# Altium schematic sheet power.SchDoc
size A4
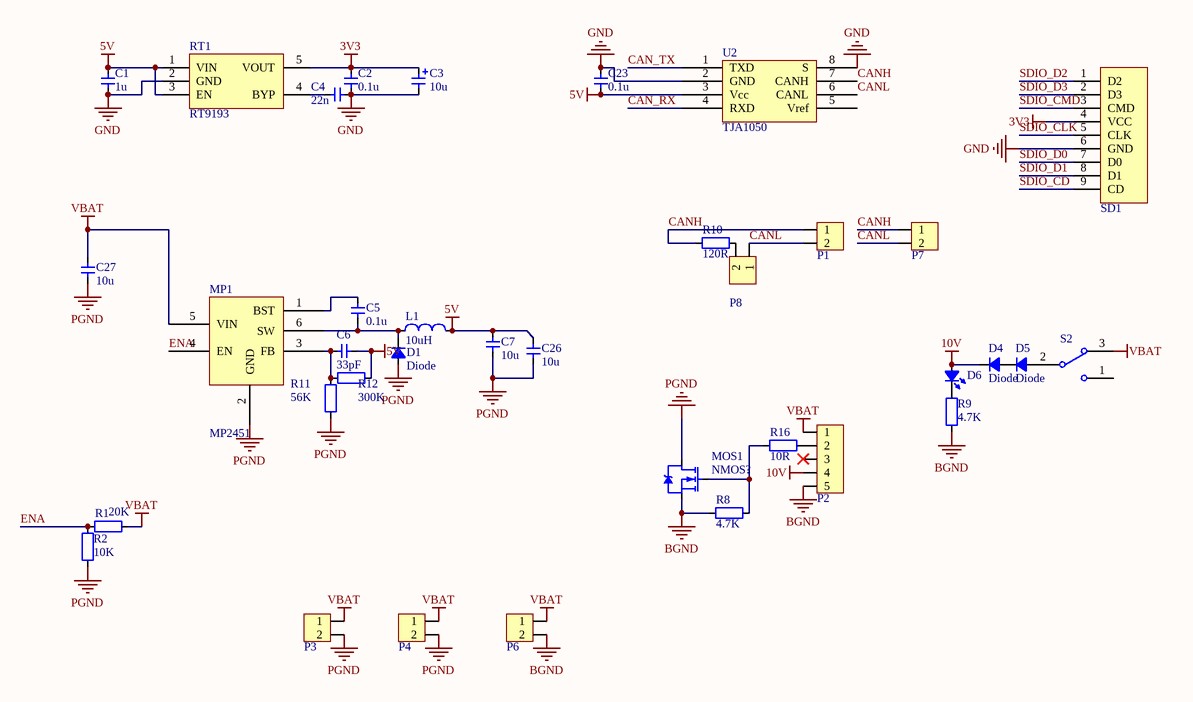
[diagram p0: power.SchDoc]

## Parts
C1  value 1u  [CAP_0603]  (hidden comment: Cap_0603)
C2  value 0.1u  [CAP_0603]  (hidden comment: Cap_0603)
C3  value 10u  [CAP_TAN_P0805]  (hidden comment: Cap_Tan_0805)
C4  value 22n  [CAP_0603]  (hidden comment: Cap_0603)
C5  value 0.1u  [CAP_0603]  (hidden comment: Cap_0603)
C6  value 33pF  [CAP_0603]  (hidden comment: Cap_0603)
C7  value 10u  [CAP_0805]  (hidden comment: Cap_0805)
C23  value 0.1u  [CAP_0603]  (hidden comment: Cap_0603)
C26  value 10u  [CAP_0805]  (hidden comment: Cap_0805)
C27  value 10u  [CAP_0805]  (hidden comment: Cap_0805)
D1  Diode  [LED_0805_RED]
D4  Diode  [LED_0805_RED]
D5  Diode  [LED_0805_RED]
D6  LED_0805  [LED_0805_RED]  (value not drawn)
L1  value 10uH  [IND_CD52]  (hidden comment: Ind_CD32)
MOS1  value NMOS?  [TO-252AA]  (hidden comment: MOSFET_N)
MP1  MP2451  [SOT23-6]
P1  HDR1x2_2.54  [HDR1X2_2.54_90]  (value not drawn)
P2  HDR1x5_2.54  [HDR1X5_2.54_180]  (value not drawn)
P3  Connector  [XT30_PW_M]  (value not drawn)
P4  Connector  [XT30_PW_M]  (value not drawn)
P6  Connector  [XT30_PW_M]  (value not drawn)
P7  HDR1x2_2.54  [HDR1X2_2.54_90]  (value not drawn)
P8  HDR1x2_2.54  [HDR1X2_2.54_180]  (value not drawn)
R1  value 20K  [RES_0603]  (hidden comment: Res_0603)
R2  value 10K  [RES_0603]  (hidden comment: Res_0603)
R8  value 4.7K  [RES_0603]  (hidden comment: Res_0603)
R9  value 4.7K  [RES_0603]  (hidden comment: Res_0603)
R10  value 120R  [RES_0603]  (hidden comment: Res_0603)
R11  value 56K  [RES_0603]  (hidden comment: Res_0603)
R12  value 300K  [RES_0603]  (hidden comment: Res_0603)
R16  value 10R  [RES_0603]  (hidden comment: Res_0603)
RT1  RT9193  [SOT23-5]
S2  SwitchSPDT_2.8x6.6_90  [SwitchSPDT_2.8X6.6_90]  (value not drawn)
SD1  SD_Card_TF  [SD_Card_TF]  (value not drawn)
U2  TJA1050  [SOP_E150_8]

## Nets
3V3: C2.2 C3.1 RT1.5(VOUT) SD1.4(VCC)
5V: C1.2 C6.1 C7.2 C23.1 C26.2 L1.2 R12.2 RT1.1(VIN) RT1.3(EN) U2.3(Vcc)
10V: D4.2(K) D6.1(A) P2.4
BGND: MOS1.3(S) P2.5 P6.2 R8.2 R9.1
GND: C1.1 C2.1 C3.2 C4.1 C23.2 RT1.2(GND) SD1.6(GND) U2.2(GND) U2.8(S)
PGND: C7.1 C26.1 C27.1 D1.1(A) MOS1.4(D) MP1.2(GND) P3.2 P4.2 R2.2 R11.2
VBAT: C27.2 MP1.5(VIN) P2.1 P3.1 P4.1 P6.1 R1.2 S2.3
CAN_RX: U2.4(RXD)
CAN_TX: U2.1(TXD)
CANH: P1.1 P7.1 R10.2 U2.7(CANH)
CANL: P1.2 P7.2 P8.1 U2.6(CANL)
ENA: MP1.4(EN) R1.1 R2.1
SDIO_CD: SD1.9(CD)
SDIO_CLK: SD1.5(CLK)
SDIO_CMD: SD1.3(CMD)
SDIO_D0: SD1.7(D0)
SDIO_D1: SD1.8(D1)
SDIO_D2: SD1.1(D2)
SDIO_D3: SD1.2(D3)
NetC4_2: C4.2 RT1.4(BYP)
NetC5_1: C5.1 D1.2(K) L1.1 MP1.6(SW)
NetC5_2: C5.2 MP1.1(BST)
NetC6_2: C6.2 MP1.3(FB) R11.1 R12.1
NetD4_1: D4.1(A) D5.2(K)
NetD5_1: D5.1(A) S2.2
NetD6_2: D6.2(K) R9.2
NetMOS1_1: MOS1.1(G) R8.1 R16.2
NetP2_2: P2.2 R16.1
NetP8_2: P8.2 R10.1

Not connected (* = marked no-connect by the designer): P2 3*; S2 1; U2 5(Vref)

## Library data of the parts
C1 C2 C4-C6 C23 = Cap_0603: Capacitor
C3 = Cap_Tan_0805: Capacitor
C7 C26 C27 = Cap_0805: Capacitor
D6 = LED_0805: LED
L1 = Ind_CD32: Inductor
MOS1 = MOSFET_N: MOSFET
P1 P7 P8 = HDR1x2_2.54: Header
P2 = HDR1x5_2.54: Header
P3 P4 P6 = 2P
R1 R2 R8-R12 R16 = Res_0603: Resistor
RT1 = RT9193: Power
S2 = SwitchSPDT_2.8x6.6_90: Switch
SD1 = SD_Card_TF: SD